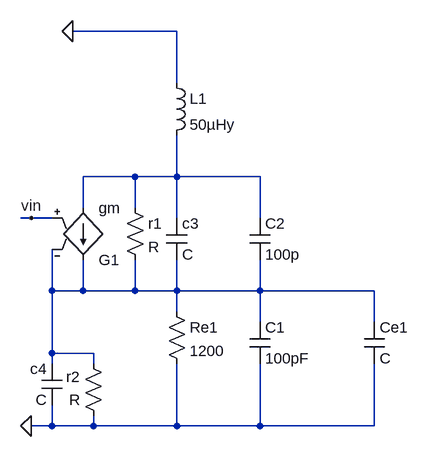
[diagram p0: schematic Collpits_d.asc]
Collpits_d.asc, the LTspice schematic file:
Version 4
SHEET 1 880 680
WIRE 176 -224 16 -224
WIRE 176 -144 176 -224
WIRE 112 0 32 0
WIRE 176 0 176 -64
WIRE 176 0 112 0
WIRE 304 0 176 0
WIRE 32 48 32 0
WIRE 112 48 112 0
WIRE -48 64 -64 64
WIRE -16 64 -48 64
WIRE 176 64 176 0
WIRE 304 64 304 0
WIRE -16 176 -16 112
WIRE 32 176 32 128
WIRE 32 176 -16 176
WIRE 112 176 112 128
WIRE 112 176 32 176
WIRE 176 176 176 128
WIRE 176 176 112 176
WIRE 304 176 304 128
WIRE 304 176 176 176
WIRE 480 176 304 176
WIRE 176 208 176 176
WIRE 304 224 304 176
WIRE 480 224 480 176
WIRE -16 272 -16 176
WIRE 48 272 -16 272
WIRE -16 288 -16 272
WIRE 48 288 48 272
WIRE -16 384 -16 352
WIRE -16 384 -48 384
WIRE 48 384 48 368
WIRE 48 384 -16 384
WIRE 176 384 176 288
WIRE 176 384 48 384
WIRE 304 384 304 288
WIRE 304 384 176 384
WIRE 480 384 480 288
WIRE 480 384 304 384
FLAG 16 -224 0
FLAG -48 384 0
FLAG -48 64 vin
SYMBOL ind 160 -160 R0
SYMATTR InstName L1
SYMATTR Value 50µHy
SYMBOL res 160 192 R0
SYMATTR InstName Re1
SYMATTR Value 1200
SYMBOL cap 288 224 R0
SYMATTR InstName C1
SYMATTR Value 100pF
SYMBOL cap 288 64 R0
SYMATTR InstName C2
SYMATTR Value 100p
SYMBOL cap 464 224 R0
SYMATTR InstName Ce1
SYMBOL cap 160 64 R0
SYMATTR InstName c3
SYMBOL res 96 32 R0
SYMATTR InstName r1
SYMBOL g2 32 144 M180
SYMATTR InstName G1
SYMATTR Value gm
SYMBOL cap 0 352 R180
WINDOW 0 24 56 Left 2
WINDOW 3 24 8 Left 2
SYMATTR InstName c4
SYMBOL res 64 384 R180
WINDOW 0 36 76 Left 2
WINDOW 3 36 40 Left 2
SYMATTR InstName r2

The netlist it stands for:
* Collpits_d.asc
L1 0 N001 50µHy
Re1 N002 0 1200
C1 N002 0 100pF
C2 N001 N002 100p
Ce1 N002 0 C
c3 N001 N002 C
r1 N001 N002 R
G1 N001 N002 vin N002 gm
c4 0 N002 C
r2 0 N002 R
.backanno
.end